# EasyEDA schematic SCH_SlimeCircle_2024-09-21.json
TITLE: SlimeCircle; REV: 1.0; Date: 2024-08-21; Sheet: 1/1; Drawn By: SmartDude; Company: n/a
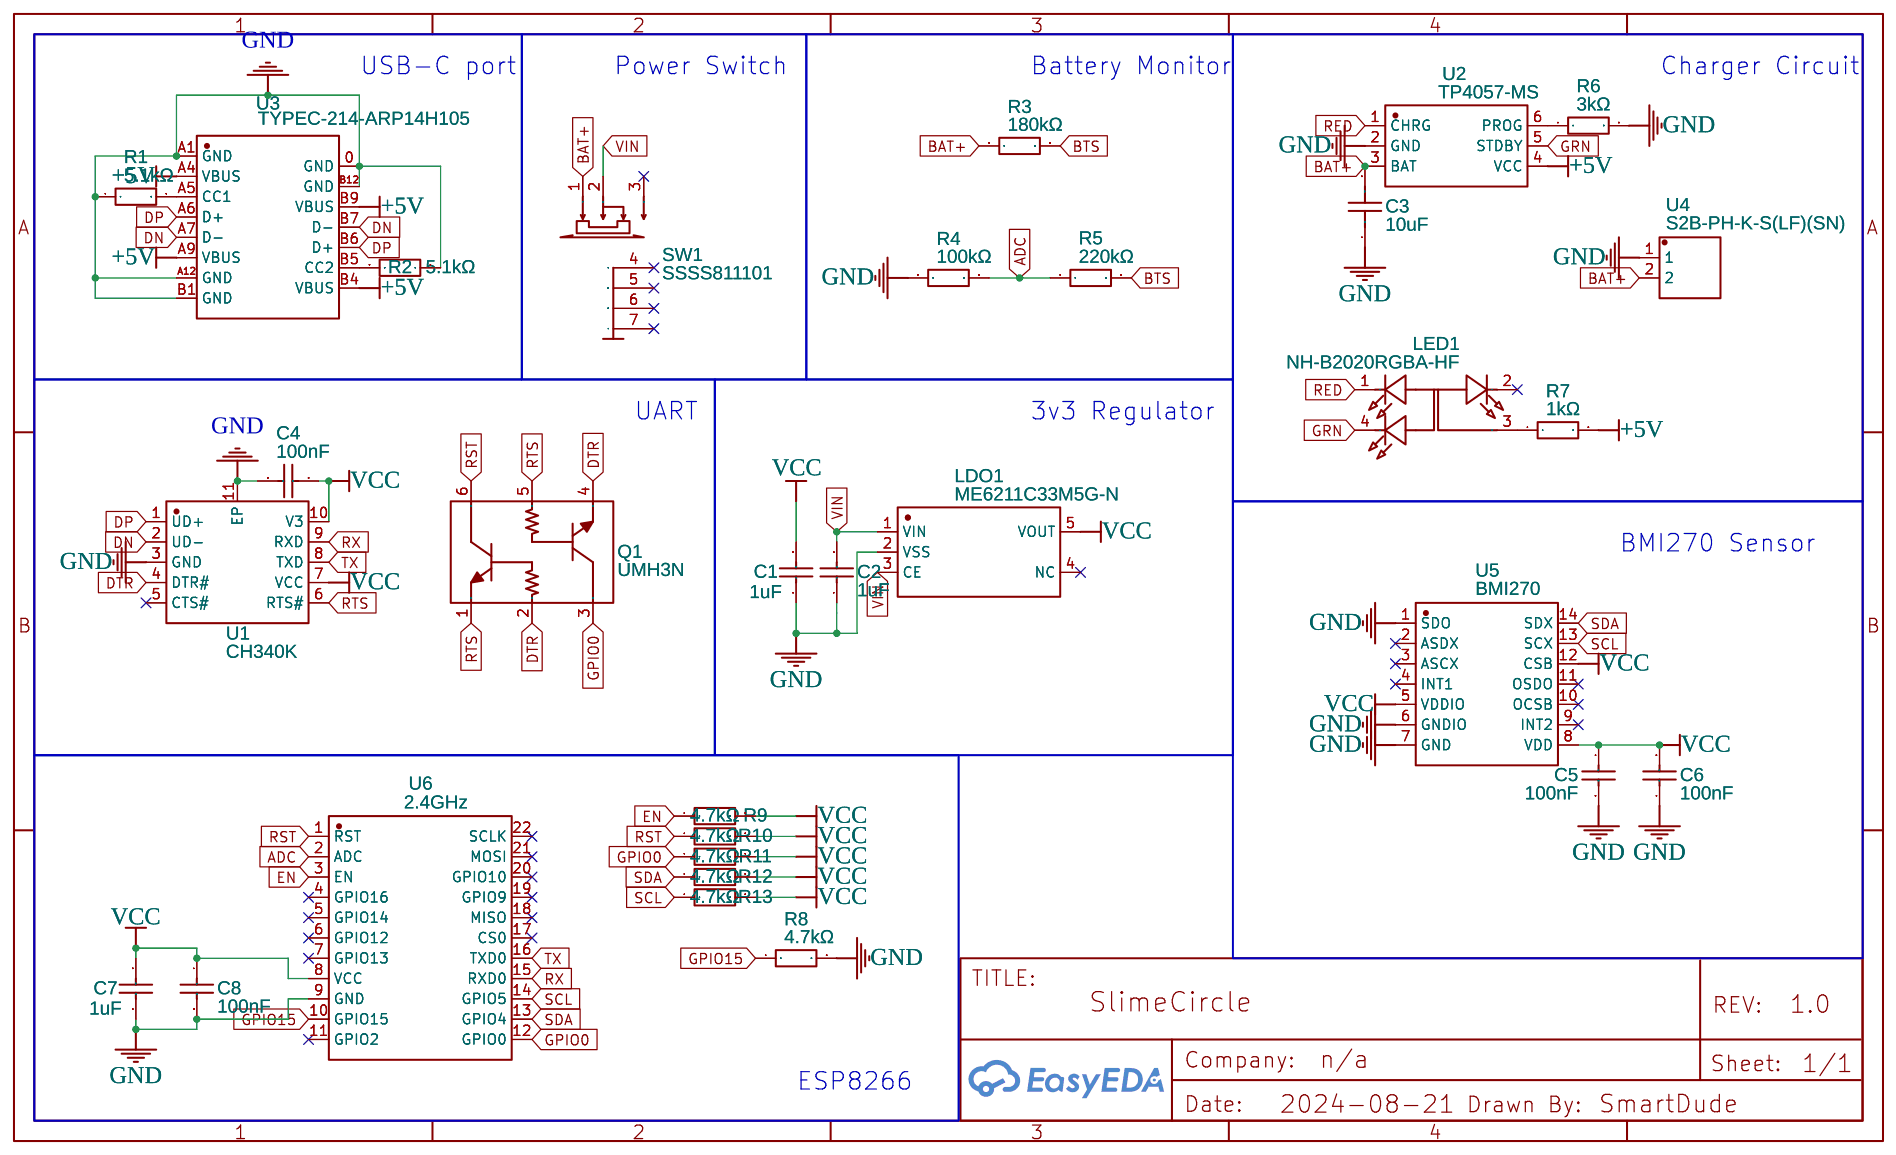
[diagram p0: schematic sheet]

## Parts
C1  1uF  [C0805]
C2  1uF  [C0805]
C3  10uF  [C0805]
C4  100nF  [C0805]
C5  100nF  [C0805]
C6  100nF  [C0805]
C7  1uF  [C0805]
C8  100nF  [C0805]
LDO1  ME6211C33M5G-N  [SOT-23-5_L3.0-W1.7-P0.95-LS2.8-BL]
LED1  NH-B2020RGBA-HF  [LED-ARRAY-SMD_4P-L2.1-W2.1-TL_NH-B2020RGBA]
Q1  UMH3N  [SC-70-6_L2.2-W1.3-P0.65-LS2.1-BR]
R1  5.1kΩ  [R0805]
R2  5.1kΩ  [R0805]
R3  180kΩ  [R0805]
R4  100kΩ  [R0805]
R5  220kΩ  [R0805]
R6  3kΩ  [R0805]
R7  1kΩ  [R0805]
R8  4.7kΩ  [R0805]
R9  4.7kΩ  [R0805]
R10  4.7kΩ  [R0805]
R11  4.7kΩ  [R0805]
R12  4.7kΩ  [R0805]
R13  4.7kΩ  [R0805]
SW1  SSSS811101  [SW-SMD_SSSS811101]
U1  CH340K  [ESOP-10_L4.9-W3.9-P1.00-LS6.2-BL-EP]
U2  TP4057-MS  [SOT-23-6_L2.9-W1.6-P0.95-LS2.8-BL]
U3  TYPEC-214-ARP14H105  [USB-TYPE-C-TH_TYPEC-214-ARP14H105]
U4  S2B-PH-K-S(LF)(SN)  [CONN-TH_S2B-PH-K-S-LF-SN]
U5  BMI270  [LGA-14_L3.0-W2.5-P0.50-BR]
U6  2.4GHz  [WIFIM-SMD_ESP-12F-ESP8266MOD]

## Library data of the parts
C1 C2 C7 = CL21B105KBFNNNE: Supplier: LCSC; Manufacturer: SAMSUNG(三星); Supplier Part: C28323; JLCPCB Part Class: Basic Part
C3 = CL21A106KAYNNNE: Supplier: LCSC; Manufacturer: SAMSUNG(三星); Supplier Part: C15850; JLCPCB Part Class: Basic Part
C4-C6 C8 = CL21B104KCFNNNE: Supplier: LCSC; Manufacturer: SAMSUNG(三星); Supplier Part: C28233; JLCPCB Part Class: Basic Part
LDO1 = ME6211C33M5G-N: Supplier: LCSC; Manufacturer: MICRONE(南京微盟); Supplier Part: C82942; JLCPCB Part Class: Extended Part
LED1 = NH-B2020RGBA-HF: Contributor: LCSC; Supplier: LCSC; Supplier Part: C2874116; Manufacturer: 国星光电; JLCPCB Part Class: Extended Part
Q1 = UMH3N: Supplier: LCSC; Manufacturer: CJ(江苏长电/长晶); Supplier Part: C62892; JLCPCB Part Class: Extended Part
R1 R2 = 0805W8F5101T5E: Supplier: LCSC; Manufacturer: UNI-ROYAL(厚声); Supplier Part: C27834; JLCPCB Part Class: Basic Part
R3 = 0805W8F1803T5E: Supplier: LCSC; Manufacturer: UNI-ROYAL(厚声); Supplier Part: C17501; JLCPCB Part Class: Extended Part
R4 = 0805W8F1003T5E_C149504: Contributor: LCSC; Supplier: LCSC; Supplier Part: C149504; Manufacturer: UNI-ROYAL(厚声); Manufacturer Part: 0805W8F1003T5E; JLCPCB Part Class: Basic Part
R5 = 0805W8F2203T5E: Supplier: LCSC; Manufacturer: UNI-ROYAL(厚声); Supplier Part: C17556; JLCPCB Part Class: Basic Part
R6 = 0805W8F3001T5E: Supplier: LCSC; Manufacturer: UNI-ROYAL(厚声); Supplier Part: C17661; JLCPCB Part Class: Basic Part
R7 = 0805W8F1001T5E: Supplier: LCSC; Manufacturer: UNI-ROYAL(厚声); Supplier Part: C17513; JLCPCB Part Class: Basic Part
R8-R13 = 0805W8F4701T5E: Supplier: LCSC; Manufacturer: UNI-ROYAL(厚声); Supplier Part: C17673; JLCPCB Part Class: Basic Part
SW1 = SSSS811101: Supplier: LCSC; Manufacturer: ALPSALPINE(阿尔卑斯阿尔派); Supplier Part: C109335; JLCPCB Part Class: Extended Part
U1 = CH340K: Contributor: LCSC; Supplier: LCSC; Supplier Part: C968586; Manufacturer: WCH(南京沁恒); JLCPCB Part Class: Extended Part
U2 = TP4057-MS: Supplier: LCSC; Supplier Part: C7473159; Manufacturer: MSKSEMI(美森科); Contributor: lcsc; JLCPCB Part Class: Extended Part
U3 = TYPEC-214-ARP14H105: Contributor: lcsc; Supplier: LCSC; Supplier Part: C2982529; Manufacturer: XUNPU(讯普); JLCPCB Part Class: Extended Part
U4 = S2B-PH-K-S(LF)(SN): Contributor: LCSC; Supplier: LCSC; Supplier Part: C173752; Manufacturer: JST; JLCPCB Part Class: Extended Part
U5 = BMI270: Contributor: LCSC; Supplier: LCSC; Supplier Part: C2836813; Manufacturer: Bosch(博世); JLCPCB Part Class: Extended Part
U6 = ESP-12F(ESP8266MOD): Supplier: LCSC; Manufacturer: Ai-Thinker(安信可); Supplier Part: C82891; JLCPCB Part Class: Extended Part

## Nets
+5V: R7.2 U2.4(VCC) U3.A4(VBUS) U3.A9(VBUS) U3.B4(VBUS) U3.B9(VBUS)
GND: C1.1 C2.1 C3.1 C4.1 C5.2 C6.1 C7.1 C8.2 LDO1.2(VSS) R1.1 R2.1 R4.1 R6.2 R8.2 U1.3(GND) U1.11(EP) U2.2(GND) U3.0(GND) U3.A1(GND) U3.A12(GND) U3.B1(GND) U3.B12(GND) U4.1 U5.1(SDO) U5.6(GNDIO) U5.7(GND) U6.9(GND)
VCC: C1.2 C4.2 C5.1 C6.2 C7.2 C8.1 LDO1.5(VOUT) R9.2 R10.2 R11.2 R12.2 R13.2 U1.7(VCC) U1.10(V3) U5.5(VDDIO) U5.8(VDD) U5.12(CSB) U6.8(VCC)
VIN: C2.2 LDO1.1(VIN) LDO1.3(CE) SW1.2
ADC: R4.2 R5.1 U6.2(ADC)
BAT+: C3.2 R3.1 SW1.1 U2.3(BAT) U4.2
BTS: R3.2 R5.2
DN: U1.2(UD-) U3.A7(D-) U3.B7(D-)
DP: U1.1(UD+) U3.A6(D+) U3.B6(D+)
DTR: Q1.2(B) Q1.4(E) U1.4(DTR#)
EN: R9.1 U6.3(EN)
GPIO0: Q1.3(C) R11.1 U6.12(GPIO0)
GPIO15: R8.1 U6.10(GPIO15)
GRN: LED1.4(-) U2.5(STDBY)
RED: LED1.1(-) U2.1(CHRG)
RST: Q1.6(C) R10.1 U6.1(RST)
RTS: Q1.1(E) Q1.5(B) U1.6(RTS#)
RX: U1.9(RXD) U6.15(RXD0)
SCL: R13.1 U5.13(SCX) U6.14(GPIO5)
SDA: R12.1 U5.14(SDX) U6.13(GPIO4)
TX: U1.8(TXD) U6.16(TXD0)
Net-(LED1-3): LED1.3(+) R7.1
Net-(R1-2): R1.2 U3.A5(CC1)
Net-(R2-2): R2.2 U3.B5(CC2)
Net-(R6-1): R6.1 U2.6(PROG)

Not connected (* = marked no-connect by the designer): LDO1 4(NC)*; LED1 2(-)*; SW1 3* 4* 5* 6* 7*; U1 5(CTS#)*; U5 2(ASDX)* 3(ASCX)* 4(INT1)* 9(INT2)* 10(OCSB)* 11(OSDO)*; U6 4(GPIO16)* 5(GPIO14)* 6(GPIO12)* 7(GPIO13)* 11(GPIO2)* 17(CS0)* 18(MISO)* 19(GPIO9)* 20(GPIO10)* 21(MOSI)* 22(SCLK)*

## Notes on the sheet
- USB-C port
- Power Switch
- Battery Monitor
- Charger Circuit
- UART
- 3v3 Regulator
- BMI270 Sensor
- ESP8266
